# EAGLE design output_controller_schematic (EAGLE 9.5.2)
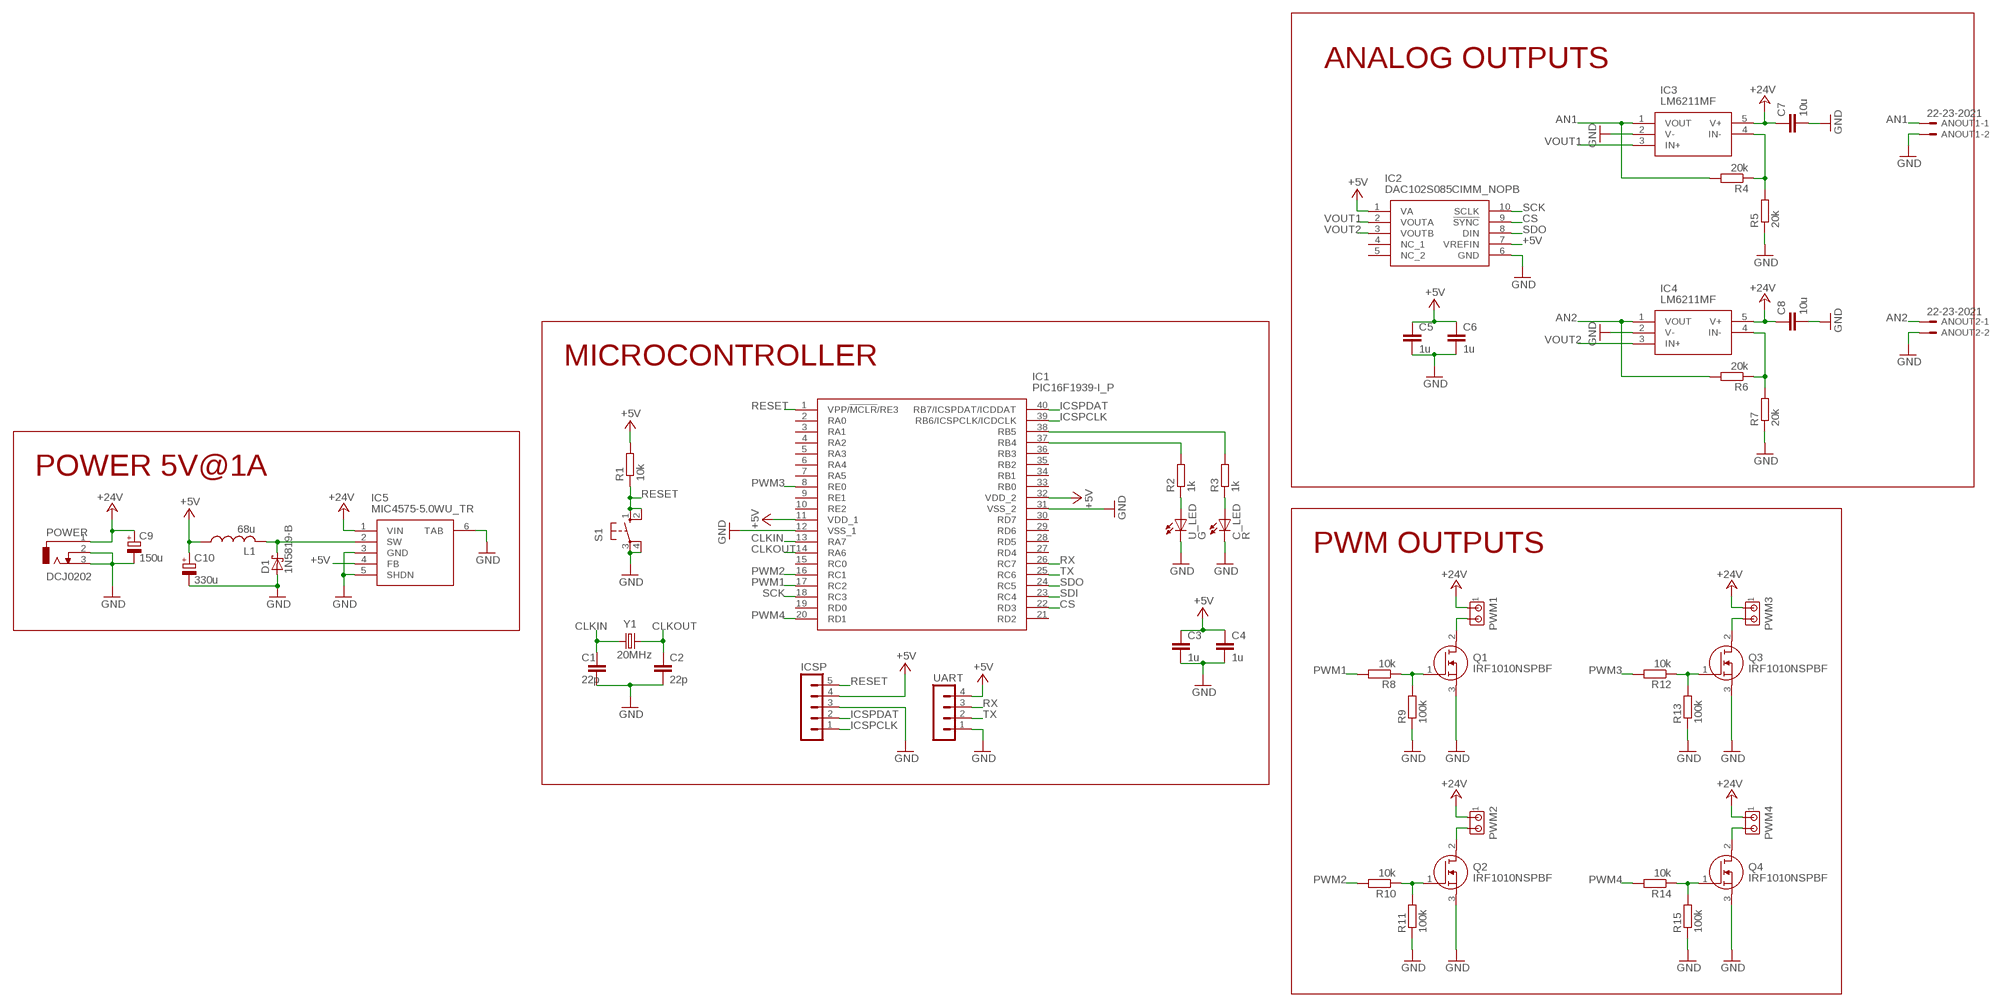
[diagram p0: schematic, sheet 1]

## Parts
ANOUT1  22-23-2021  [22-23-2021]
ANOUT2  22-23-2021  [22-23-2021]
C1  22p  C-EUC1206  [C1206]
C2  22p  C-EUC1206  [C1206]
C3  1u  C-EUC1206  [C1206]
C4  1u  C-EUC1206  [C1206]
C5  1u  C-EUC1206  [C1206]
C6  1u  C-EUC1206  [C1206]
C7  10u  C-EUC1206  [C1206]
C8  10u  C-EUC1206  [C1206]
C9  150u  CPOL-EU175TMP-0810  [175TMP-0810]
C10  330u  CPOL-EU175TMP-0810  [175TMP-0810]
C_LED  R  LEDCHIPLED_1206  [CHIPLED_1206]
D1  1N5819-B  [DO41-7.6]
IC1  PIC16F1939-I_P  [DIP1543W58P254L5175H635Q40N]
IC2  DAC102S085CIMM_NOPB  [SOP50P490X110-10N]
IC3  LM6211MF  [SOT95P284X122-5N]
IC4  LM6211MF  [SOT95P284X122-5N]
IC5  MIC4575-5.0WU_TR  [MIC2930112WU]
ICSP  MA05-1  [MA05-1]
L1  68u  L-USL5650M  [L5650M]
POWER  DCJ0202  [DCJ0202]
PWM1  MTA02-156  [1X2MTA]
PWM2  MTA02-156  [1X2MTA]
PWM3  MTA02-156  [1X2MTA]
PWM4  MTA02-156  [1X2MTA]
Q1  IRF1010NSPBF  [IRF2804STRLPBF]
Q2  IRF1010NSPBF  [IRF2804STRLPBF]
Q3  IRF1010NSPBF  [IRF2804STRLPBF]
Q4  IRF1010NSPBF  [IRF2804STRLPBF]
R1  10k  R-EU_R1206  [R1206]
R2  1k  R-EU_R1206  [R1206]
R3  1k  R-EU_R1206  [R1206]
R4  20k  R-EU_R1206  [R1206]
R5  20k  R-EU_R1206  [R1206]
R6  20k  R-EU_R1206  [R1206]
R7  20k  R-EU_R1206  [R1206]
R8  10k  R-EU_R1206  [R1206]
R9  100k  R-EU_R1206  [R1206]
R10  10k  R-EU_R1206  [R1206]
R11  100k  R-EU_R1206  [R1206]
R12  10k  R-EU_R1206  [R1206]
R13  100k  R-EU_R1206  [R1206]
R14  10k  R-EU_R1206  [R1206]
R15  100k  R-EU_R1206  [R1206]
S1  10-XX  [B3F-10XX]
U_LED  G  LEDCHIPLED_1206  [CHIPLED_1206]
UART  MA04-1  [MA04-1]
Y1  20MHz  CRYSTALHC49S  [HC49/S]

## Nets
+5V: C3.1 C4.1 C5.1 C6.1 C10.+ IC1.11(VDD_1) IC1.32(VDD_2) IC2.1(VA) IC2.7(VREFIN) IC5.4(FB) ICSP.4 L1.1 R1.2 UART.4
+24V: C7.1 C8.1 C9.+ IC3.5(V+) IC4.5(V+) IC5.1(VIN) POWER.1 PWM1.1 PWM2.1 PWM3.1 PWM4.1
AN1: ANOUT1.1 IC3.1(VOUT) R4.2
AN2: ANOUT2.1 IC4.1(VOUT) R6.2
CLKIN: C1.1 IC1.13(RA7) Y1.1
CLKOUT: C2.1 IC1.14(RA6) Y1.2
CS: IC1.22(RD3) IC2.9(!SYNC)
GND: ANOUT1.2 ANOUT2.2 C1.2 C2.2 C3.2 C4.2 C5.2 C6.2 C7.2 C8.2 C9.- C10.- C_LED.C D1.A IC1.12(VSS_1) IC1.31(VSS_2) IC2.6(GND) IC3.2(V-) IC4.2(V-) IC5.3(GND) IC5.5(SHDN) IC5.6(TAB) ICSP.3 POWER.2 POWER.3 Q1.3(S) Q2.3(S) Q3.3(S) Q4.3(S) R5.1 R7.1 R9.1 R11.1 R13.1 R15.1 S1.3(P) S1.4(P1) U_LED.C UART.1
ICSPCLK: IC1.39(RB6/ICSPCLK/ICDCLK) ICSP.1
ICSPDAT: IC1.40(RB7/ICSPDAT/ICDDAT) ICSP.2
N$3: IC3.4(IN-) R4.1 R5.2
N$4: IC4.4(IN-) R6.1 R7.2
N$5: IC1.38(RB5) R3.2
N$6: IC1.37(RB4) R2.2
N$7: R2.1 U_LED.A
N$8: C_LED.A R3.1
N$9: Q1.1(G) R8.1 R9.2
N$10: PWM1.2 Q1.2(D)
N$11: Q2.1(G) R10.1 R11.2
N$12: PWM2.2 Q2.2(D)
N$13: Q3.1(G) R12.1 R13.2
N$14: PWM3.2 Q3.2(D)
N$15: Q4.1(G) R14.1 R15.2
N$16: PWM4.2 Q4.2(D)
N$18: D1.C IC5.2(SW) L1.2
PWM1: IC1.17(RC2) R8.2
PWM2: IC1.16(RC1) R10.2
PWM3: IC1.8(RE0) R12.2
PWM4: IC1.20(RD1) R14.2
RESET: IC1.1(VPP/!MCLR!/RE3) ICSP.5 R1.1 S1.1(S) S1.2(S1)
RX: IC1.26(RC7) UART.3
SCK: IC1.18(RC3) IC2.10(SCLK)
SDI: IC1.23(RC4)
SDO: IC1.24(RC5) IC2.8(DIN)
TX: IC1.25(RC6) UART.2
VOUT1: IC2.2(VOUTA) IC3.3(IN+)
VOUT2: IC2.3(VOUTB) IC4.3(IN+)
Unconnected: IC1.2(RA0) IC1.3(RA1) IC1.4(RA2) IC1.5(RA3) IC1.6(RA4) IC1.7(RA5) IC1.9(RE1) IC1.10(RE2) IC1.15(RC0) IC1.19(RD0) IC1.21(RD2) IC1.27(RD4) IC1.28(RD5) IC1.29(RD6) IC1.30(RD7) IC1.33(RB0) IC1.34(RB1) IC1.35(RB2) IC1.36(RB3) IC2.4(NC_1) IC2.5(NC_2)

## Notes on the sheet
- ANALOG OUTPUTS
- MICROCONTROLLER
- POWER 5V@1A
- PWM OUTPUTS

## Library data of the parts
ANOUT1 ANOUT2 = con-molex:22-23-2021: .100" (2.54mm) Center Header - 2 Pin; MF: MOLEX; MPN: 22-23-2021; OC_FARNELL: 1462926; OC_NEWARK: 25C3832
C1-C8 = rcl:C-EU: CAPACITOR, European symbol; SPICEPREFIX: C
C9 C10 = rcl:CPOL-EU: POLARIZED CAPACITOR, European symbol; SPICEPREFIX: C
C_LED U_LED = led:LED: LED OSRAM: - CHIPLED LG R971, LG N971, LY N971, LG Q971, LY Q971, LO R971, LY R971 LH N974, LH R974 LS Q976, LO Q976, LY Q976 LO Q996 - Hyper CHIPLED LW Q18S LB Q993, LB Q99A, LB R99A - SideLED LS A670, LO A670, LY A670, LG A670, LP A670 LB A673, LV A673, LT A673, LW A673 LH A674 LY A675 LS A676, LA A676, LO A676, LY A676, LW A676 LS A679, LY A679, LG A679 - Hyper Micro SIDELED® LS Y876, LA Y876, LO Y876, LY Y876 LT Y87S - SmartLED LW L88C, LW L88S LB L89C, LB L89S, LG L890 LS L89K, LO L89K, LY L89K LS L896, LA L896, LO L896, LY L896 - TOPLED LS T670, LO T670, LY T670, LG T670, LP T670 LSG T670, LSP T670, LSY T670, LOP T670, LYG T670 LG T671, LOG T671, LSG T671 LB T673, LV T673, LT T673, LW T673 LH T674 LS T676, LA T676, LO T676, LY T676, LB T676, LH T676, LSB T676, LW T676 LB T67C, LV T67C, LT T67C, LS T67K, LO T67K, LY T67K, LW E67C LS E67B, LA E67B, LO E67B, LY E67B, LB E67C, LV E67C, LT E67C LW T67C LS T679, LY T679, LG T679 LS T770, LO T770, LY T770, LG T770, LP T770 LB T773, LV T773, LT T773, LW T773 LH T774 LS E675, LA E675, LY E675, LS T675 LS T776, LA T776, LO T776, LY T776, LB T776 LHGB T686 LT T68C, LB T68C - Hyper Mini TOPLED® LB M676 - Mini TOPLED Santana® LG M470 LS M47K, LO M47K, LY M47K Source: http://www.osram.convergy.de LUXEON: - LUMILED® LXK2-PW12-R00, LXK2-PW12-S00, LXK2-PW14-U00, LXK2-PW14-V00 LXK2-PM12-R00, LXK2-PM12-S00, LXK2-PM14-U00 LXK2-PE12-Q00, LXK2-PE12-R00, LXK2-PE12-S00, LXK2-PE14-T00, LXK2-PE14-U00 LXK2-PB12-K00, LXK2-PB12-L00, LXK2-PB12-M00, LXK2-PB14-N00, LXK2-PB14-P00, LXK2-PB14-Q00 LXK2-PR12-L00, LXK2-PR12-M00, LXK2-PR14-Q00, LXK2-PR14-R00 LXK2-PD12-Q00, LXK2-PD12-R00, LXK2-PD12-S00 LXK2-PH12-R00, LXK2-PH12-S00 LXK2-PL12-P00, LXK2-PL12-Q00, LXK2-PL12-R00 Source: www.luxeon.com KINGBRIGHT: KA-3528ASYC Source: www.kingbright.com
D1 = diode:1N581*: 1.0A SCHOTTKY BARRIER RECTIFIER Source: http://www.diodes.com/datasheets/ds23001.pdf
IC1 = PIC16F1939-I_P:PIC16F1939-I_P: Microchip PIC16F1939-I/P, 8bit PIC Microcontroller, 32MHz, 28 kB Flash, 40-Pin PDIP Source: Datasheet <https://datasheet.datasheetarchive.com/originals/distributors/Datasheets-SFU1/DSASFU10002417.pdf>; ARROW_PART_NUMBER: PIC16F1939-I/P; ARROW_PRICE-STOCK: https://www.arrow.com/en/products/pic16f1939-ip/microchip-technology; DESCRIPTION: Microchip PIC16F1939-I/P, 8bit PIC Microcontroller, 32MHz, 28 kB Flash, 40-Pin PDIP; HEIGHT: 6.35mm; MANUFACTURER_NAME: Microchip; MANUFACTURER_PART_NUMBER: PIC16F1939-I/P; MOUSER_PART_NUMBER: 579-PIC16F1939-I/P; MOUSER_PRICE-STOCK: https://www.mouser.co.uk/ProductDetail/Microchip-Technology/PIC16F1939-I-P?qs=DAV8Y8VhPTI151YmS0fnjw%3D%3D
IC2 = DAC102S085CIMM_NOPB:DAC102S085CIMM_NOPB: 10-Bit Micro Power DUAL Digital-to-Analog Converter with Rail-to-Rail Output Source: Datasheet <https://www.ti.com/lit/ds/symlink/dac102s085.pdf?ts=1600169506760&ref_url=https%3A%2F%2Fwww.ti.com%2Fstore%2Fti%2Fen%2Fp%2Fproduct%2F%3Fp%3DDAC102S085CIMM%2FNOPB%26keyMatch%3DDAC102S085CIMM%2FNOPB%26tisearch%3DSearch-EN-e>; ARROW_PART_NUMBER: DAC102S085CIMM/NOPB; ARROW_PRICE-STOCK: https://www.arrow.com/en/products/dac102s085cimmnopb/texas-instruments; DESCRIPTION: 10-Bit Micro Power DUAL Digital-to-Analog Converter with Rail-to-Rail Output; HEIGHT: 1.1mm; MANUFACTURER_NAME: Texas Instruments; MANUFACTURER_PART_NUMBER: DAC102S085CIMM/NOPB; MOUSER_PART_NUMBER: 926-DA102S085CIMMNPB; MOUSER_PRICE-STOCK: https://www.mouser.com/Search/Refine.aspx?Keyword=926-DA102S085CIMMNPB
IC3 IC4 = LM6211MF:LM6211MF: Operational Amplifier Source: Datasheet; ARROW_PART_NUMBER: LM6211MF; ARROW_PRICE-STOCK: https://www.arrow.com/en/products/lm6211mf/texas-instruments; DESCRIPTION: Operational Amplifier; HEIGHT: mm; MANUFACTURER_NAME: Texas Instruments; MANUFACTURER_PART_NUMBER: LM6211MF; MOUSER_PART_NUMBER: 926-LM6211MF; MOUSER_PRICE-STOCK: https://www.mouser.com/Search/Refine.aspx?Keyword=926-LM6211MF
IC5 = MIC4575-5.0WU_TR:MIC4575-5.0WU_TR: Conv DC-DC 4V to 24V Step Down Single-Out 5V 1A 6-Pin(5+Tab) TO-263 T/R Source: Datasheet <https://static6.arrow.com/aropdfconversion/70f7d448c03473d77199e91ba4a73e49885a727a/mic4575.pdf>; ARROW_PART_NUMBER: MIC4575-5.0WU TR; ARROW_PRICE-STOCK: https://www.arrow.com/en/products/mic4575-5.0wu-tr/microchip-technology; DESCRIPTION: Conv DC-DC 4V to 24V Step Down Single-Out 5V 1A 6-Pin(5+Tab) TO-263 T/R; HEIGHT: 9.017mm; MANUFACTURER_NAME: Microchip; MANUFACTURER_PART_NUMBER: MIC4575-5.0WU TR
ICSP = con-lstb:MA05-1: PIN HEADER; OC_FARNELL: unknown; OC_NEWARK: unknown
L1 = rcl:L-US: INDUCTOR, American symbol; SPICEPREFIX: L
POWER = con-jack:DCJ0202: DC POWER JACK Source: DCJ0202.pdf; OC_FARNELL: unknown; OC_NEWARK: unknown
PWM1-PWM4 = con-amp:MTA02-156: AMP connector
Q1-Q4 = IRF1010NSPBF:IRF1010NSPBF: IRF1010NSPBF N-Channel MOSFET, 85 A, 55 V HEXFET, 3-Pin D2PAK Infineon Source: Datasheet <https://www.infineon.com/dgdl/Infineon-IRF1010NS-DS-v01_00-EN.pdf?fileId=5546d46258fc0bc10158fee33da90638>; ARROW_PART_NUMBER: IRF1010NSPBF; ARROW_PRICE-STOCK: https://www.arrow.com/en/products/irf1010nspbf/infineon-technologies-ag; DESCRIPTION: IRF1010NSPBF N-Channel MOSFET, 85 A, 55 V HEXFET, 3-Pin D2PAK Infineon; HEIGHT: 4.83mm; MANUFACTURER_NAME: Infineon; MANUFACTURER_PART_NUMBER: IRF1010NSPBF; MOUSER_PART_NUMBER: 942-IRF1010NSPBF; MOUSER_PRICE-STOCK: https://www.mouser.com/Search/Refine.aspx?Keyword=942-IRF1010NSPBF
R1-R15 = rcl:R-EU_: RESISTOR, European symbol; SPICEPREFIX: R
S1 = switch-omron:10-XX: OMRON SWITCH; MPN: B3F-1000; OC_FARNELL: 176432; OC_NEWARK: 36M3542
UART = con-lstb:MA04-1: PIN HEADER; OC_FARNELL: unknown; OC_NEWARK: unknown
Y1 = adafruit:CRYSTAL: CRYSTAL; OC_FARNELL: 1667008; OC_NEWARK: unknown

## Board
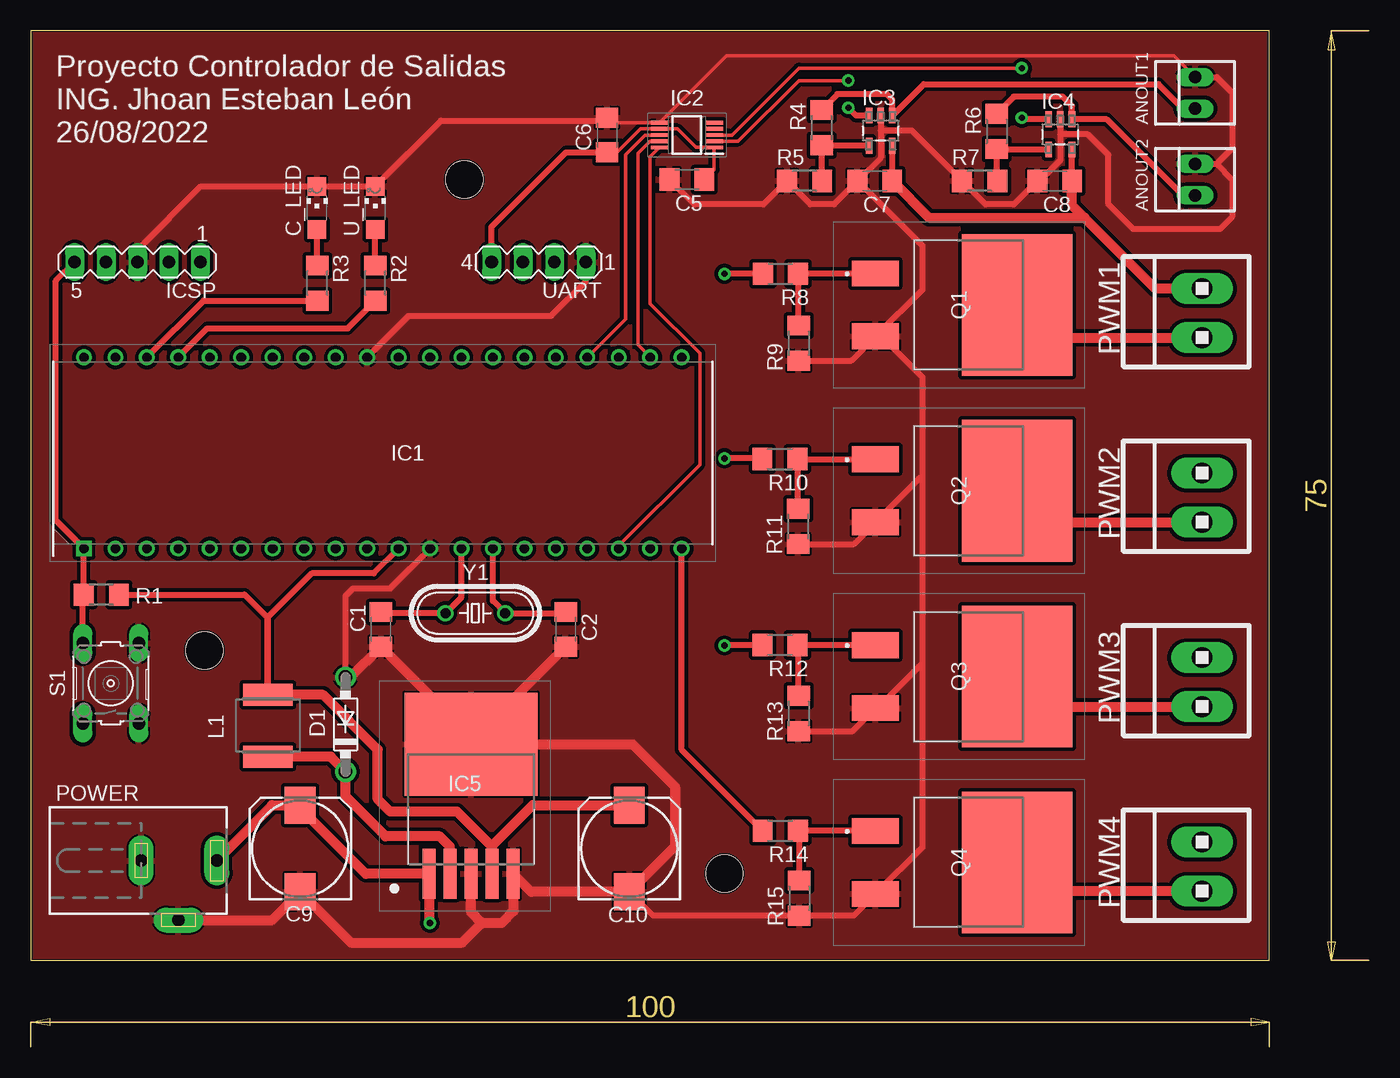
[diagram p1: board, top side]
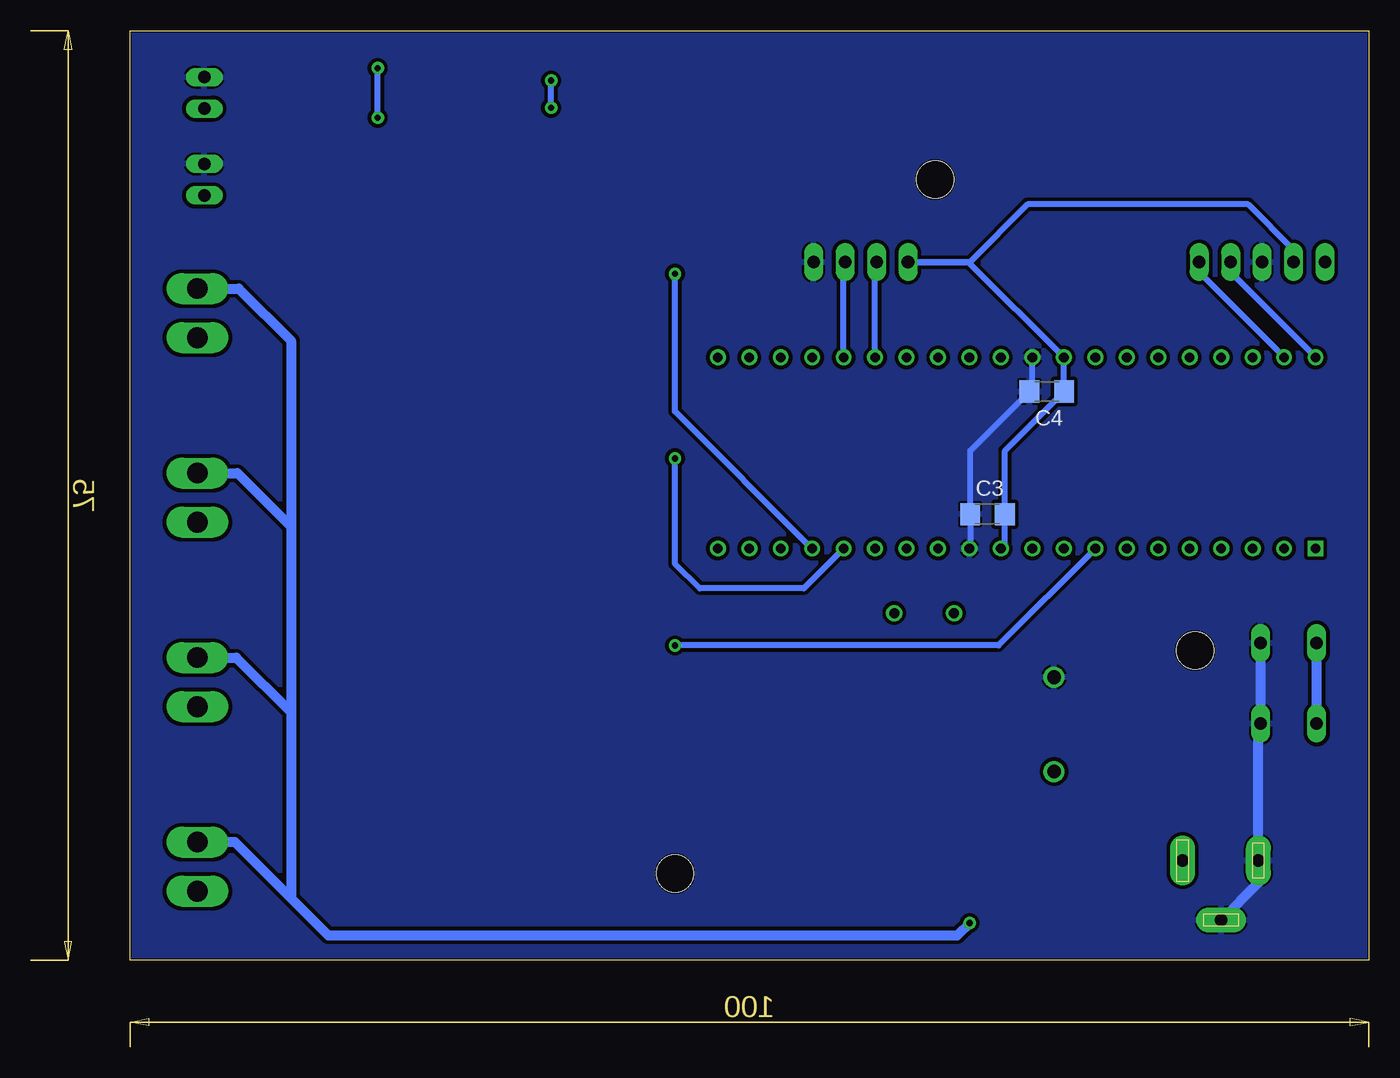
[diagram p2: board, bottom side, seen from below]

Size 100 x 75 mm. Coordinates in mm from the lower left corner, seen from the top.
Outline: 0,0 100,0 100,75 0,75 0,0
Copper layers (1*16): Top 0.035mm / dielectric 1.5mm / Bottom 0.035mm
Design rules "designrules_colcircuitos": minimum track width 0.3mm, minimum drill 0.4mm, track to track 0.3mm, track to pad 0.3mm, pad to pad 0.3mm, via to via 0.3mm, smd to smd 4mil, copper to edge 5mil, drill to drill 6mil, minimum pad ring 0.25mm, minimum via ring 0.25mm, stop-mask expansion 4mil, vias tented up to drill 0mil, thermal gap 7mil
Holes 3 mm at 14,25 56,7 35,63

### Footprints (pad centres in the part's own frame; a part is rotated, then mirrored left to right if it is on the bottom)
22-23-2021 = drill 1 long: 1 -1.27,0; 2 1.27,0
C1206 = smd 1.6 x 1.8: 1 -1.4,0; 2 1.4,0
175TMP-0810 = smd 3 x 2.5: + 3.5,0; - -3.5,0
CHIPLED_1206 = smd 1.5 x 1.5: A 0,-1.75; C 0,1.75
DO41-7.6 = drill 1.1 pad 1.7: A 3.81,0; C -3.81,0
DIP1543W58P254L5175H635Q40N = drill 0.784 pad 1.184 square: 1 -7.715,24.13 | drill 0.784 pad 1.184: 2 -7.715,21.59; 3 -7.715,19.05; 4 -7.715,16.51; 5 -7.715,13.97; 6 -7.715,11.43; 7 -7.715,8.89; 8 -7.715,6.35; 9 -7.715,3.81; 10 -7.715,1.27; 11 -7.715,-1.27; 12 -7.715,-3.81; 13 -7.715,-6.35; 14 -7.715,-8.89; 15 -7.715,-11.43; 16 -7.715,-13.97; 17 -7.715,-16.51; 18 -7.715,-19.05; 19 -7.715,-21.59; 20 -7.715,-24.13; 21 7.715,-24.13; 22 7.715,-21.59; 23 7.715,-19.05; 24 7.715,-16.51; 25 7.715,-13.97; 26 7.715,-11.43; 27 7.715,-8.89; 28 7.715,-6.35; 29 7.715,-3.81; 30 7.715,-1.27; 31 7.715,1.27; 32 7.715,3.81; 33 7.715,6.35; 34 7.715,8.89; 35 7.715,11.43; 36 7.715,13.97; 37 7.715,16.51; 38 7.715,19.05; 39 7.715,21.59; 40 7.715,24.13
SOP50P490X110-10N = smd 1.4 x 0.3: 1 -2.2,1; 2 -2.2,0.5; 3 -2.2,0; 4 -2.2,-0.5; 5 -2.2,-1; 6 2.2,-1; 7 2.2,-0.5; 8 2.2,0; 9 2.2,0.5; 10 2.2,1
SOT95P284X122-5N = smd 1.27 x 0.533: 1 -1.219,0.94; 2 -1.219,0; 3 -1.219,-0.94; 4 1.219,-0.94; 5 1.219,0.94
MIC2930112WU = smd 1.042 x 4.039: 1 -2.744,-4.539; 2 -1.042,-4.539; 3 0.66,-4.539; 4 2.362,-4.539; 5 4.064,-4.539 | smd 10.744 x 8.306: 6 0.66,5.913
MA05-1 = drill 1.016 long: 1 -5.08,0; 2 -2.54,0; 3 0,0; 4 2.54,0; 5 5.08,0
L5650M = smd 1.8 x 4: 1 -2.5,0; 2 2.5,0
DCJ0202 = drill 1 pad 2 long: 1 0,3.1; 2 4.8,0; 3 0,-3
1X2MTA = drill 1.676 long: 1 1.981,0; 2 -1.981,0
IRF2804STRLPBF = smd 2.08 x 3.81: 1 -2.54,-4.75; 3 2.54,-4.75 | smd 11.43 x 8.89: 2 0,6.68
R1206 = smd 1.6 x 1.803: 1 -1.422,0; 2 1.422,0
B3F-10XX = drill 1.016 long: 1 -3.251,2.261; 2 3.251,2.261; 3 -3.251,-2.261; 4 3.251,-2.261
MA04-1 = drill 1.016 long: 1 -3.81,0; 2 -1.27,0; 3 1.27,0; 4 3.81,0
HC49/S = drill 0.813: 1 -2.413,0; 2 2.413,0

### Placement (x,y rotation side)
ANOUT1  94,70 90 top
ANOUT2  94,63 90 top
C1  28.26,26.71 270 top
C2  43.18,26.71 270 top
C3  30.76,36 180 bottom
C4  25.98,45.9 180 bottom
C5  52.96,63 180 top
C6  46.52,66.6 90 top
C7  68.14,62.9 180 top
C8  82.66,62.9 180 top
C9  21.74,9.01 90 top
C10  48.31,9.01 90 top
C_LED  23.09,60.71 0 top
D1  25.4,19.03 90 top
IC1  28.41,40.94 90 top
IC2  52.96,66.6 180 top
IC3  68.61,66.95 270 top
IC4  83.11,66.65 270 top
IC5  34.88,11.5 0 top
ICSP  8.6,56.35 180 top
L1  19.13,18.92 270 top
POWER  11.9,8.04 270 top
PWM1  94.56,52.23 90 top
PWM2  94.56,37.34 90 top
PWM3  94.56,22.44 90 top
PWM4  94.56,7.55 90 top
Q1  72.94,52.89 270 top
Q2  72.94,37.89 270 top
Q3  72.94,22.89 270 top
Q4  72.94,7.89 270 top
R1  5.68,29.5 0 top
R2  27.8,54.65 270 top
R3  23.12,54.65 270 top
R4  63.84,67.2 90 top
R5  62.46,62.9 0 top
R6  77.98,66.9 90 top
R7  76.6,62.9 0 top
R8  60.52,55.4 180 top
R9  61.99,49.81 90 top
R10  60.46,40.45 180 top
R11  61.94,35.01 90 top
R12  60.48,25.45 180 top
R13  61.99,19.91 90 top
R14  60.5,10.45 180 top
R15  62.04,5.01 90 top
S1  6.45,22.34 90 top
U_LED  27.8,60.71 0 top
UART  41,56.35 180 top
Y1  35.88,28.01 0 top

### Tracks (layer width: path | path; a pad name or v marks a point on that pad's centre or on a via)
+5V
  Top 0.3: C5.1 55.16,63.8 IC2.1 53.7,65.6 52.2,67.1 IC2.7 49.22,67.1 47.32,65.2 C6.1
  Top 0.5: R1.2 17.25,29.5 19.13,27.62 L1.1 19.13,27.68 22.68,31.23 27.68,31.23 IC1.11 | UART.4 37.19,59.19 43.2,65.2 C6.1
  Top 0.8: C10.+ 40.51,12.51 37.24,9.24 IC5.4 37.24,9.16 34.4,12 29,12 28,13 28,17 23.58,21.42 L1.1
  Bottom 0.5: IC1.11 29.36,33.55 C3.1 29.36,41.12 C4.1 24.58,48.63 IC1.32 32.3,56.35 UART.4 32.19,56.35 27.54,61 9.71,61 6.06,57.35 ICSP.4
+24V  (via drill 0.5)
  Top 0.5: C8.1 IC4.5 | C7.1 IC3.5
  Top 0.8: POWER.1 19.47,12.51 C9.+ 21.74,12.26 27.04,6.96 IC5.1 32.13,3.06 v32.2,3 | PWM1.1 90.79,54.21 85.06,59.94 | C8.1 84.06,60.94 85.06,59.94 | C7.1 72.5,59.94 85.06,59.94
  Bottom 0.8: v32.2,3 33.2,2 84,2 87,5 | PWM4.1 91.53,9.53 87,5 | PWM3.1 91.42,24.43 87,20 | 87,20 87,5 | PWM2.1 91.32,39.32 87,35 | 87,35 87,20 | PWM1.1 91.21,54.21 87,50 87,35
AN1
  Top 0.5: R4.2 65.12,69.9 69.1,69.9 69.55,69.45 IC3.1 72.08,70.7 91.03,70.7 93,68.73 ANOUT1.1
AN2
  Top 0.5: ANOUT2.1 93,61.73 86.86,67.87 IC4.1 84.05,68.95 83.3,69.7 79.36,69.7 R6.2
CLKIN
  Top 0.5: C1.1 28.36,28.01 Y1.1 34.76,29.3 IC1.13
CLKOUT
  Top 0.5: IC1.14 37.3,29 Y1.2 43.08,28.01 C2.1
CS
  Top 0.3: IC1.22 49,49.66 49,65.12 49.98,66.1 IC2.9
GND
  Top 0.3: 45.76,67.76 45.92,67.6 IC2.6 56.16,73 92.27,73 ANOUT1.2 | 46.76,67.76 C6.2
  Top 0.5: C10.- 50.23,3.59 R15.1 66.43,3.59 Q4.3 72,9.15 72,24 | 72,24 72,39 | 72,39 72,47 68.65,50.35 Q1.3 | R13.1 66.33,18.49 Q3.3 68.35,20.35 72,24 | R11.1 66.43,33.59 Q2.3 71.84,39 72,39 | R9.1 66.23,48.39 Q1.3 | IC4.2 83.11,66.65 | 83.11,66.65 83.11,64.55 81.46,62.9 C8.2 79.36,61 77.08,61 R7.1 71.13,66.95 68.61,66.95 | IC3.2 68.61,66.95 | 68.61,66.95 68.61,64.77 C7.2 | C7.2 64.84,61 62.94,61 R5.1 59.14,61 53.56,61 C5.2 | Q1.3 72,54.16 72,57.64 C7.2 | ANOUT2.2 95.73,64.27 | 95.73,64.27 97,63 97,60 96,59 89,59 87,61 87,65 85.35,66.65 83.11,66.65 | ANOUT1.2 95.73,71.27 97,70 97,65.54 95.73,64.27 | D1.A 25.4,29.4 26,30 29,30 IC1.12 | IC1.31 30.48,52 42,52 44.81,54.81 UART.1 | ICSP.3 8.6,57.35 13.71,62.46 C_LED.C U_LED.C 33.1,67.76 45.76,67.76 46.76,67.76 | 35.54,17.67 IC5.6 35.54,16.54
  Top 0.8: POWER.2 19.47,3.24 C9.- 25.83,1.42 34.82,1.42 36.4,3 | 36.4,3 38,3 38.94,3.94 IC5.5 40.39,5.51 C10.- 52,9.2 52,14 48.59,17.41 IC5.6 | 36.4,3 35.54,3.86 IC5.3 | 35.54,16.54 36,17 36,17.57 C1.2 25.79,22.84 D1.A | 35.54,17.67 C2.2
  Bottom 0.5: IC1.31 27.14,46.14 C4.2 32.16,41.12 C3.2 32.16,33.28 IC1.12
  Bottom 0.8: POWER.2 8.9,6.24 POWER.3 8.9,18.9 S1.3 S1.4
  pour Bottom: 0,75 0,0 100,0 100,75
  pour Top: 0,75 0,0 100,0 100,75
ICSPCLK
  Bottom 0.5: IC1.39 13.68,55.52 ICSP.1
ICSPDAT
  Bottom 0.5: IC1.40 11.14,55.52 ICSP.2
N$3
  Top 0.5: R5.2 63.88,65.74 | 63.88,65.74 R4.1 | IC3.4 63.89,65.73 63.88,65.74
N$4
  Top 0.5: R7.2 77.98,62.94 R6.1 78.03,65.43 IC4.4
N$5
  Top 0.5: IC1.38 13.93,53.23 R3.2
N$6
  Top 0.5: IC1.37 14.24,51 25.57,51 R2.2
N$7
  Top 0.5: R2.1 U_LED.A
N$8
  Top 0.5: R3.1 23.12,58.93 C_LED.A
N$9
  Top 0.5: Q1.1 68.17,55.4 R8.1 61.99,55.35 R9.2
N$10
  Top 0.8: Q1.2 82.27,50.25 PWM1.2
N$11
  Top 0.5: R11.2 61.94,40.39 R10.1 68.17,40.45 Q2.1
N$12
  Top 0.8: Q2.2 82.16,35.35 PWM2.2
N$13
  Top 0.5: R12.1 62,25.45 | 62,25.45 68.17,25.45 Q3.1 | R13.2 61.99,25.44 62,25.45
N$14
  Top 0.8: Q3.2 82.05,20.46 PWM3.2
N$15
  Top 0.5: R15.2 62.04,10.33 R14.1 61.94,10.43 Q4.1
N$16
  Top 0.8: PWM4.2 81.95,5.57 Q4.2
N$18
  Top 0.8: IC5.2 33.84,9.16 33,10 28.62,10 25.4,13.22 D1.C 24.2,16.42 L1.2
PWM1  (via drill 0.5)
  Top 0.5: R8.2 v56,55.4
  Bottom 0.5: IC1.17 56,44.3 v56,55.4
PWM2  (via drill 0.5)
  Top 0.5: R10.2 58.99,40.5 v56,40.5
  Bottom 0.5: IC1.16 45.6,30 54,30 56,32 v56,40.5
PWM3  (via drill 0.5)
  Top 0.5: R12.2 59.01,25.4 v56,25.4
  Bottom 0.5: IC1.8 29.89,25.4 v56,25.4
PWM4
  Top 0.5: R14.2 52.54,16.99 IC1.20
RESET
  Top 0.5: S1.2 4.19,29.43 R1.1 4.26,33.2 IC1.1 2,35.51 2,54.83 ICSP.5
  Bottom 0.8: S1.1 S1.2
RX
  Bottom 0.5: IC1.26 39.84,56.24 UART.3
SCK
  Top 0.3: IC1.18 47.46,33.46 54,40 54,49 50,53 50,64.84 IC2.10
SDO
  Top 0.3: IC1.24 48,51.73 48,65 49.6,66.6 IC2.8
TX
  Bottom 0.5: IC1.25 42.38,56.24 UART.2
VOUT1  (via drill 0.5)
  Top 0.3: IC2.2 57.1,66.1 62,71 v66,71
  Top 0.5: IC3.3 66.63,68.17 v66,68.8
  Bottom 0.5: v66,68.8 v66,71
VOUT2  (via drill 0.5)
  Top 0.3: IC2.3 56.6,66.6 62,72 v80,72
  Top 0.5: IC4.3 80.13,67.87 v80,68
  Bottom 0.5: v80,68 v80,72

### Text on the board
tPlace: Proyecto Controlador de Salidas / ING. Jhoan Esteban León / 26/08/2022